# EAGLE design Mic-Breakout_v10 (EAGLE 7.5.0)
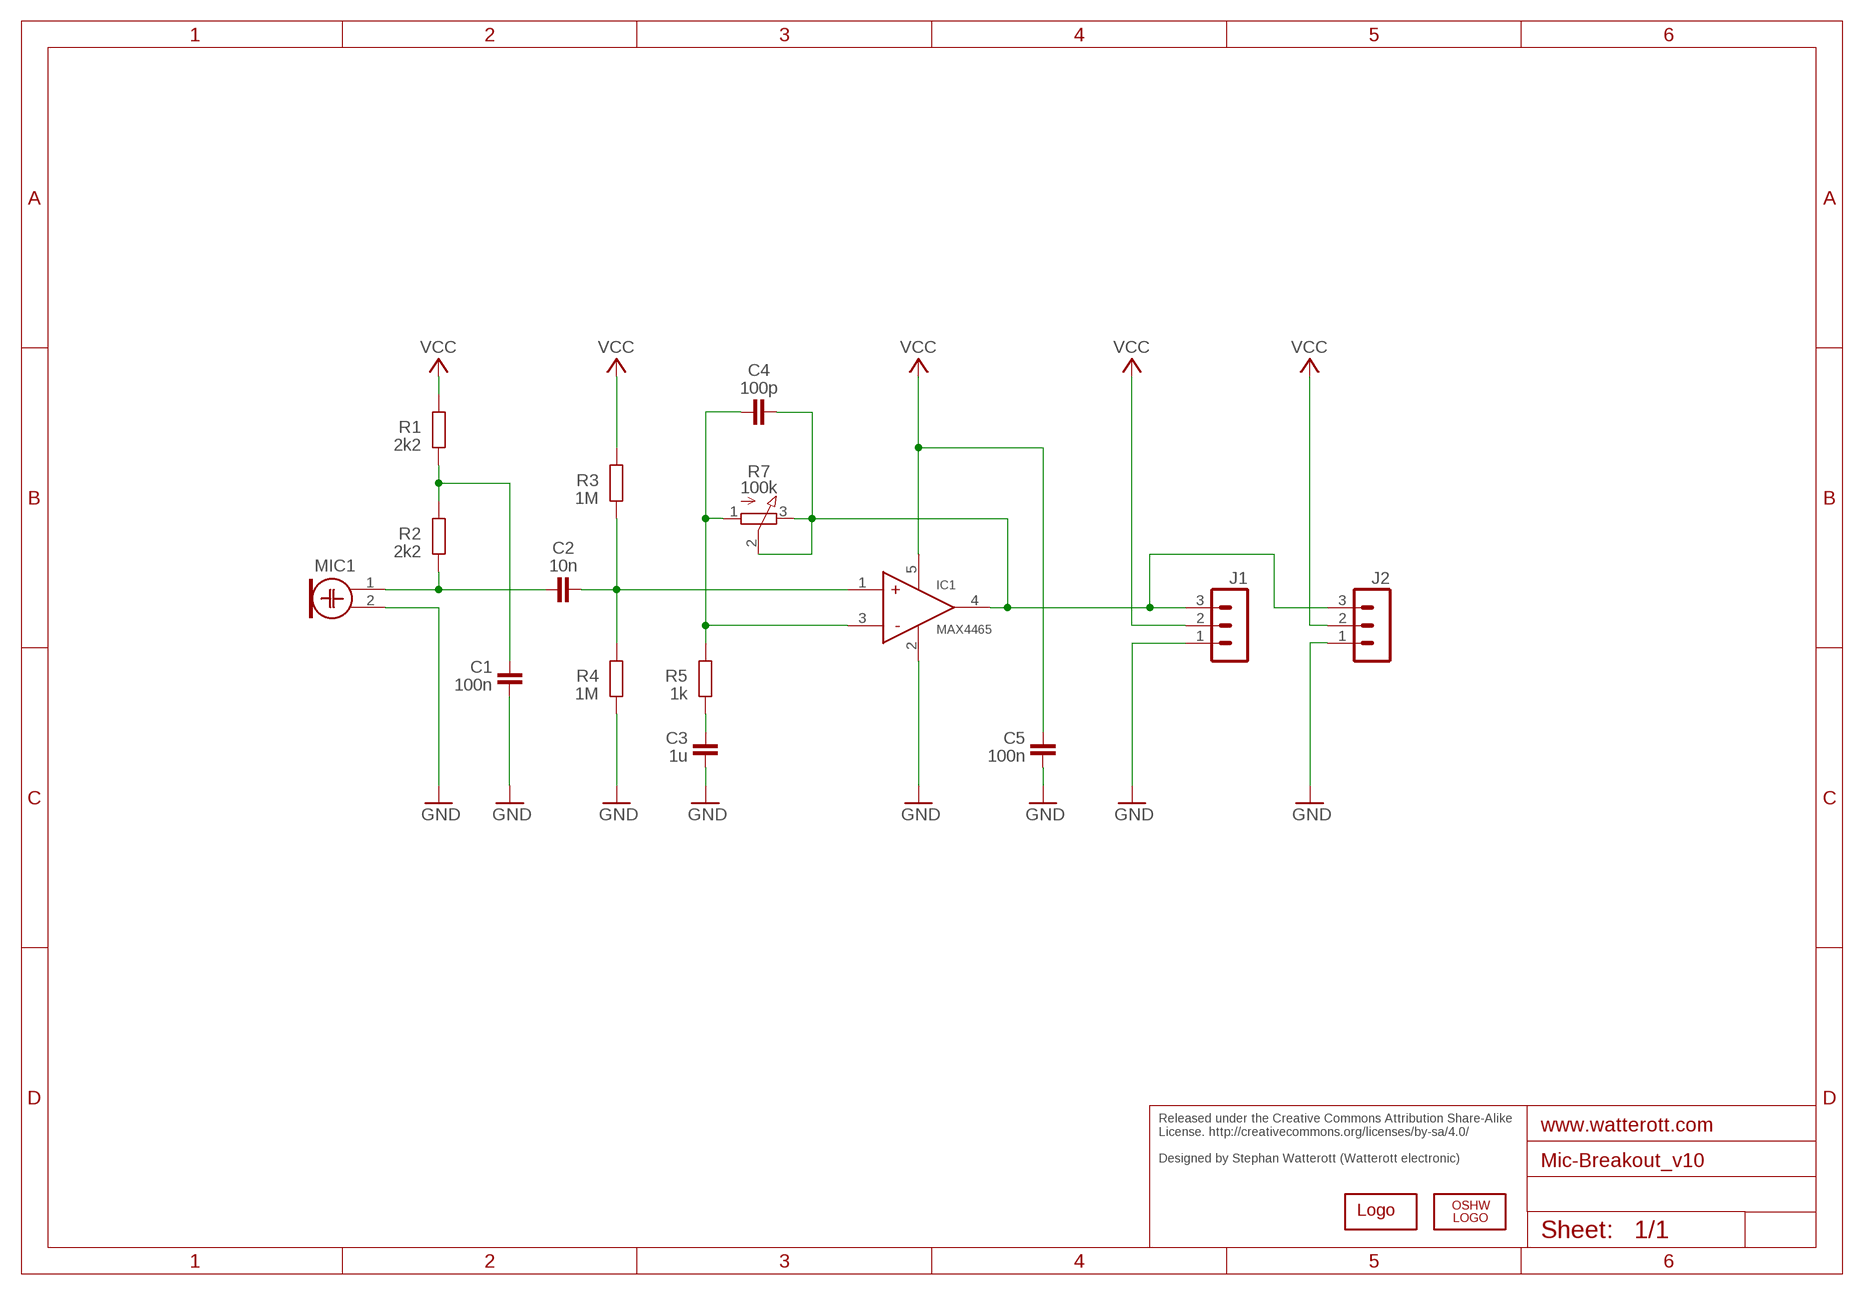
[diagram p0: schematic, sheet 1]

## Parts
C1  100n  CAPACITOR-C0402  [R0402]
C2  10n  CAPACITOR-C0402  [R0402]
C3  1u  CAPACITOR-C0402  [R0402]
C4  100p  CAPACITOR-C0402  [R0402]
C5  100n  CAPACITOR-C0402  [R0402]
IC1  MAX4465  [SOT23-5]
J1  MA03-1  [MA03-1]
J2  JST_PH_3S3B-PH-SM4-TB  [JST_S3B-PH-SM4-TB]
LOGO1  LOGO-S_PLACE_M  [SPARK_TPLACE_M]
LOGO2  OSHW_LOGOX0100  [OSHW_6X100]
MIC1  CMA-4544PF  [CMA-4544PF]
R1  2k2  RESISTOR-R0402  [R0402]
R2  2k2  RESISTOR-R0402  [R0402]
R3  1M  RESISTOR-R0402  [R0402]
R4  1M  RESISTOR-R0402  [R0402]
R5  1k  RESISTOR-R0402  [R0402]
R7  100k  POTEVM3Y  [POT_EVM3Y]

## Nets
GND: C1.1 C3.1 C5.1 IC1.2(GND) J1.1 J2.1 MIC1.2 R4.1
N$1: C1.2 R1.1 R2.2
N$2: C2.2 IC1.1(+) R3.1 R4.2
N$3: C4.1 IC1.4(OUT) J1.3 J2.3 R7.2(S) R7.3(E)
N$4: C2.1 MIC1.1 R2.1
N$5: C4.2 IC1.3(-) R5.2 R7.1(A)
N$6: C3.2 R5.1
VCC: C5.2 IC1.5(VCC) J1.2 J2.2 R1.2 R3.2

## Notes on the sheet
- Released under the Creative Commons Attribution Share-Alike 
  License. http://creativecommons.org/licenses/by-sa/4.0/
  
  Designed by Stephan Watterott (Watterott electronic)

## Library data of the parts
C1-C5 = we-rcl:CAPACITOR: Capacitors ...4.7uF @ 6.3V -> 0402 ...10uF @ 16V -> 0603 ...22uF @ 25V -> 0805
IC1 = we-chip:MAX4465: Maxim MAX4465...MAX4469 OP Amp for microphone preamplifiers
J1 = we-con:MA03-1: Pin Header
J2 = we-con:JST_PH_3: JST Connector
LOGO1 = we-symbol:LOGO: Watterott electronic Logo
LOGO2 = we-symbol:OSHW_LOGO: Open-Source-Hardware Logo
MIC1 = we-sensor:CMA-4544PF: CUI CMA-4544PF-W Electret Condenser Microphone
R1-R5 = we-rcl:RESISTOR: Resistors all kinds in 0603 and 0402
R7 = we-rcl:POT: Potentiometer

## Board
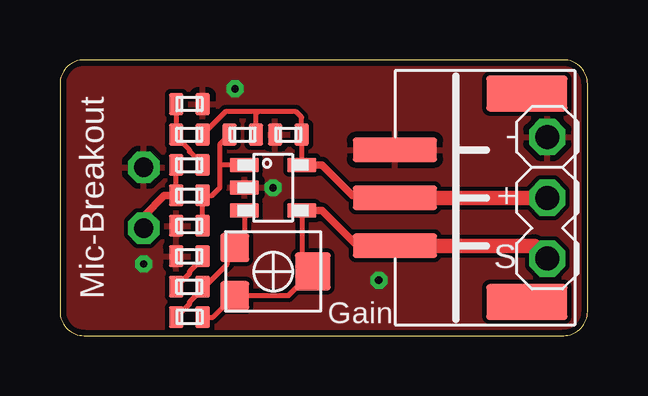
[diagram p1: board, top side]
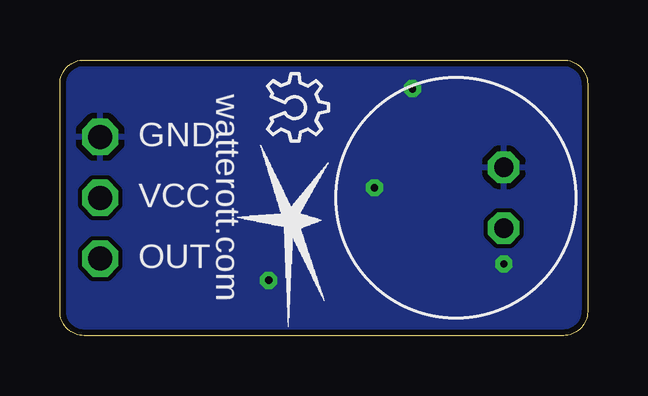
[diagram p2: board, bottom side, seen from below]

Size 22 x 11.5 mm. Coordinates in mm from the lower left corner, seen from the top.
Outline: 1,0 21,0 arc90 22,1 22,10.5 arc90 21,11.5 1,11.5 arc90 0,10.5 0,1 arc90 1,0
Copper layers (1*16): Top 0.035mm / dielectric 1.5mm / Bottom 0.035mm
Design rules "default *": minimum track width 7mil, minimum drill 0.3mm, track to track 7mil, track to pad 7mil, pad to pad 7mil, via to via 7mil, smd to smd 7mil, copper to edge 10mil, drill to drill 8mil, minimum pad ring 10mil, minimum via ring 8mil, stop-mask expansion 4mil, vias tented up to drill 0.5mm, thermal gap 10mil

### Footprints (pad centres in the part's own frame; a part is rotated, then mirrored left to right if it is on the bottom)
R0402 = smd 0.9 x 0.6: 1 0,0.55; 2 0,-0.55
SOT23-5 = smd 1.2 x 0.6: 1 -1.2,0.95; 2 -1.2,0; 3 -1.2,-0.95; 4 1.2,-0.95; 5 1.2,0.95
MA03-1 = drill 1 octagon: 1 0,2.54; 2 0,0; 3 0,-2.54
JST_S3B-PH-SM4-TB = smd 3.5 x 1: 1 -3.81,2; 2 -3.81,0; 3 -3.81,-2 | smd 3.4 x 1.5: SHLD1 1.69,4.35; SHLD2 1.69,-4.35
CMA-4544PF = drill 0.8 octagon: 1 0,1.27; 2 0,-1.27
POT_EVM3Y = smd 1.2 x 1.2: 1 -1,-1.6; 3 1,-1.6 | smd 1.6 x 1.5: 2 0,1.65

### Placement (x,y rotation side)
C1  5.4,9.66 270 top
C2  5.4,5.85 90 top
C3  5.4,3.31 90 top
C4  5.4,0.77 270 top
C5  9.53,8.39 90 top
IC1  8.89,6.17 0 top
J1  20.32,5.75 0 top
J2  17.78,5.75 0 top
LOGO1  12.38,4.76 270 bottom
LOGO2  13.34,10.93 270 bottom
MIC1  3.49,5.75 180 bottom
R1  5.4,8.39 90 top
R2  5.4,7.12 90 top
R3  7.62,8.39 90 top
R4  5.4,4.58 90 top
R5  5.4,2.04 90 top
R7  8.89,2.67 270 top

### Tracks (layer width: path | path; a pad name or v marks a point on that pad's centre or on a via)
GND  (via drill 0.3)
  other vias: 7.3,10.29 8.89,6.17 3.49,2.99 13.29,2.31
  pour Bottom: 0,0 0,11.45 21.91,11.45 21.91,0
  pour Top: 0,0.01 0,11.45 21.91,11.45 21.91,0.01
N$1
  Top 0.2: R2.2 5.4,7.67 5.4,7.75 4.85,8.3 R1.1 C1.2
N$2
  Top 0.2: R4.2 C2.2 6.35,5.85 6.67,6.17 6.67,7.12 | 6.67,7.12 6.67,7.99 R3.1 | IC1.1 6.67,7.12
N$3
  Top 0.2: C4.1 6.38,0.77 R7.3 9.54,1.68 R7.2 10.09,3.12 IC1.4
  Top 0.305: J2.3 12.29,3.85 10.93,5.21 IC1.4
  Top 0.61: J2.3 19.78,3.75 J1.3
N$4
  Top 0.2: C2.1 R2.1
  Top 0.305: 4.76,5.85 4.35,5.85 3.5,5 MIC1.1
  Top 0.406: C2.1 4.76,5.85
N$5
  Top 0.2: C4.2 5.4,1.32 5.4,1.41 5.95,1.96 R5.2 6.03,2.04 6.99,2.99 6.99,3.37 R7.1 7.69,4.08 IC1.3
N$6
  Top 0.2: C3.2 5.95,3.23 5.4,2.67 5.4,2.59 R5.1
VCC
  Top 0.2: 8.26,9.34 9.84,9.34 10.07,9.11 C5.2 10.07,7.13 IC1.5 | 8.26,9.34 6.9,9.34 R1.2 | R3.2 8.17,9.26 8.26,9.34
  Top 0.305: IC1.5 10.93,7.12 12.2,5.85 J2.2
  Top 0.61: J2.2 J1.2

### Text on the board
tPlace: - | Mic-Breakout | + | S | Gain
bPlace: GND | watterott.com | VCC | OUT